# Altium schematic sheet BSP.SchDoc
size A4
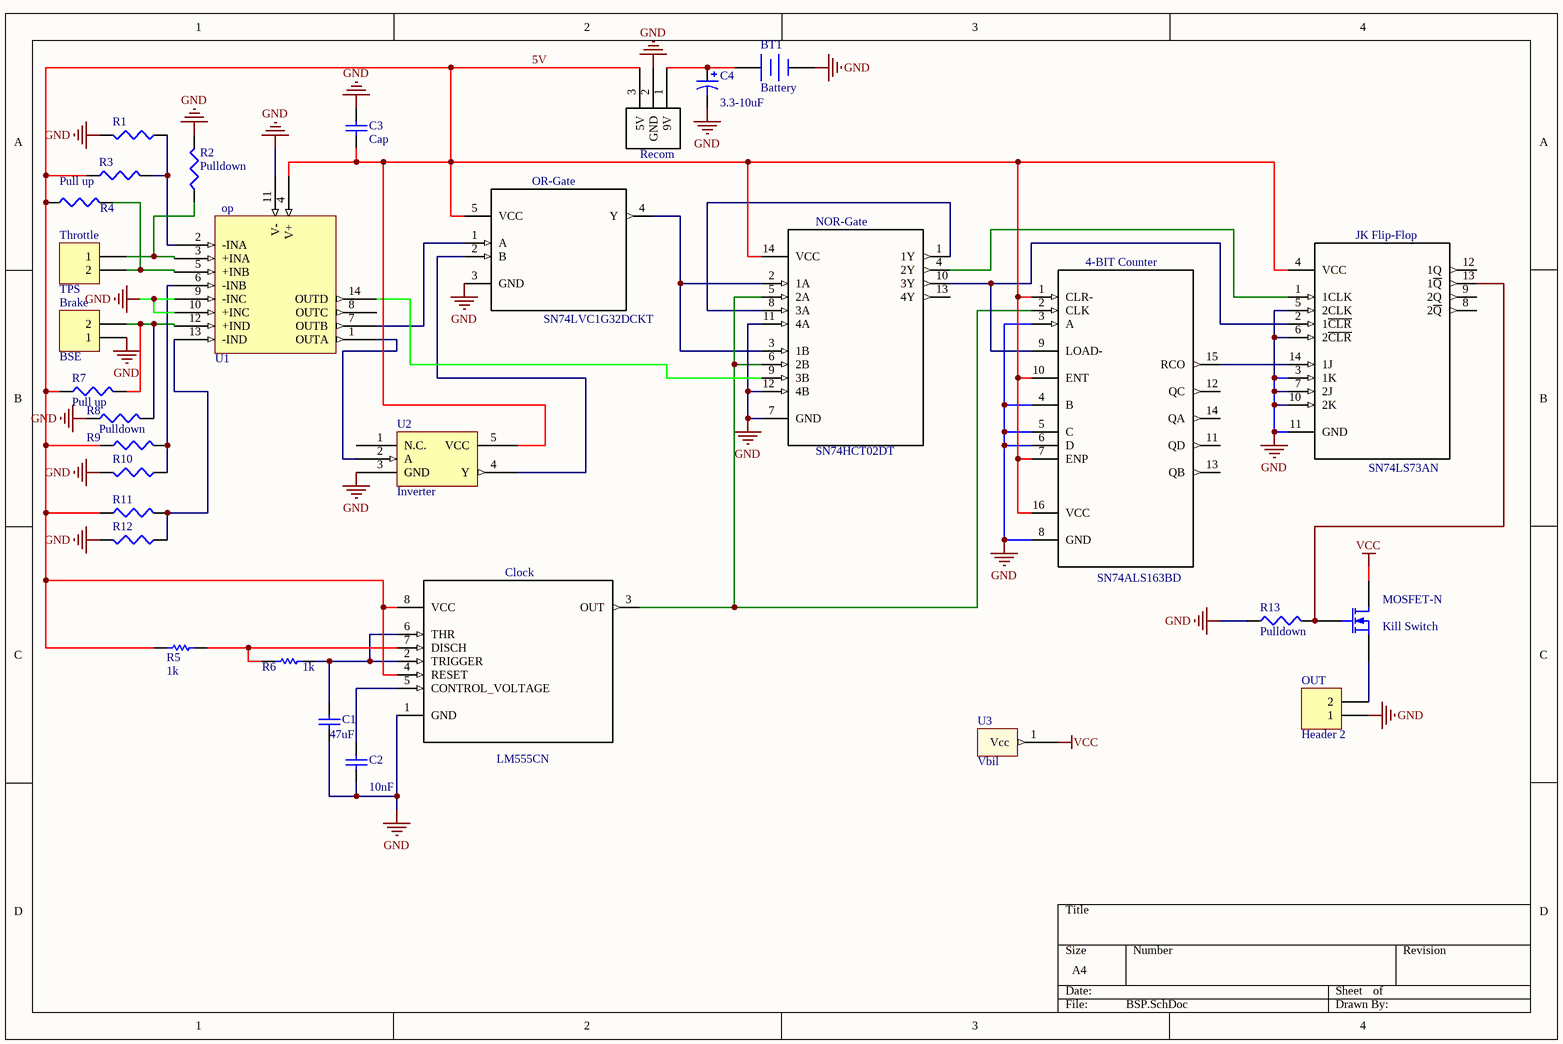
[diagram p0: BSP.SchDoc]

## Parts
4-BIT_Counter  SN74ALS163BD  [SOIC127P600X175-16N]
*  Recom  [RECOMM]
Brake  BSE  [HDR1X2]
BT1  Battery  [HDR1X2]
C1  value 47uF  [C5750]
C2  value 10nF  [Resistor0805]
C3  Cap  [Resistor0805]
C4  value 3.3-10uF  [CAPR5-4X5]  (hidden comment: Cap Pol1)
Clock  LM555CN  [DIP254P762X533-8]
JK_Flip-Flop  SN74LS73AN  [DIP254P762X508-14]
MOSFET-N  Kill Switch  [DPAK228P998X280-3N]
NOR-Gate  SN74HCT02DT  [SOIC127P600X175-14N]
OR-Gate  SN74LVC1G32DCKT  [SOT65P210X110-5N]
OUT  Header 2  [HDR1X2]
R1  (no value)  [Resistor0805]
R2  Pulldown  [Resistor0805]
R3  (no value)  [Resistor0805]
R4  Pull up  [Resistor0805]
R5  R5  value 1k  [Resistor0805]
R6  value 1k  [Resistor0805]
R7  Pull up  [Resistor0805]
R8  Pulldown  [Resistor0805]
R9  (no value)  [Resistor0805]
R10  (no value)  [Resistor0805]
R11  (no value)  [Resistor0805]
R12  (no value)  [Resistor0805]
R13  Pulldown  [Resistor0805]
Throttle  TPS  [HDR1X2H]
U1  op  [SOP127P600X175-14N]
U2  Inverter  [SOT95P245X145-5N]
U3  Vbil  [VCC]

## Nets
GND: 4-BIT_Counter.3(A) 4-BIT_Counter.4(B) 4-BIT_Counter.5(C) 4-BIT_Counter.6(D) 4-BIT_Counter.8(GND) *.2(GND) Brake.1 BT1.2(-) C1.1 C2.1 C3.1 C4.2 Clock.1(GND) JK_Flip-Flop.3(1K) JK_Flip-Flop.5(2CLK) JK_Flip-Flop.6(2~{CLR}) JK_Flip-Flop.7(2J) JK_Flip-Flop.10(2K) JK_Flip-Flop.11(GND) NOR-Gate.7(GND) NOR-Gate.11(4A) NOR-Gate.12(4B) OR-Gate.3(GND) OUT.1 R1.2 R2.2 R8.1 R10.2 R12.2 R13.1 U1.9(-INC) U1.10(+INC) U1.11(V-) U2.3(GND)
VCC: MOSFET-N.1(D) U3.1(Vcc)
5V: 4-BIT_Counter.1(CLR-) 4-BIT_Counter.7(ENP) 4-BIT_Counter.10(ENT) 4-BIT_Counter.16(VCC) *.3(5V) C3.2 Clock.4(RESET) Clock.8(VCC) JK_Flip-Flop.4(VCC) NOR-Gate.14(VCC) OR-Gate.5(VCC) R3.1 R4.1 R5.2 R7.1 R9.1 R11.1 U1.4(V+) U2.5(VCC)
Net4-BIT_Counter_2: 4-BIT_Counter.2(CLK) Clock.3(OUT) NOR-Gate.5(2A) NOR-Gate.6(2B)
Net4-BIT_Counter_9: 4-BIT_Counter.9(LOAD-) JK_Flip-Flop.2(1~{CLR}) NOR-Gate.10(3Y)
Net4-BIT_Counter_15: 4-BIT_Counter.15(RCO) JK_Flip-Flop.14(1J)
Net*_1: *.1(9V) BT1.1(+) C4.1
NetBrake_2: Brake.2 R7.2 R8.2 U1.12(+IND)
NetC1_2: C1.2 Clock.2(TRIGGER) Clock.6(THR) R6.1
NetC2_2: C2.2 Clock.5(CONTROL_VOLTAGE)
NetClock_7: Clock.7(DISCH) R5.1 R6.2
NetJK_Flip-Flop_1: JK_Flip-Flop.1(1CLK) NOR-Gate.4(2Y)
NetJK_Flip-Flop_13: JK_Flip-Flop.13(1~{Q}) MOSFET-N.2(G) R13.2
NetMOSFET-N_3: MOSFET-N.3(S) OUT.2
NetNOR-Gate_1: NOR-Gate.1(1Y) NOR-Gate.8(3A)
NetNOR-Gate_2: NOR-Gate.2(1A) NOR-Gate.3(1B) OR-Gate.4(Y)
NetNOR-Gate_9: NOR-Gate.9(3B) U1.14(OUTD)
NetOR-Gate_1: OR-Gate.1(A) U1.7(OUTB)
NetOR-Gate_2: OR-Gate.2(B) U2.4(Y)
NetR1_1: R1.1 R3.2 U1.2(-INA)
NetR2_1: R2.1 Throttle.2(1) U1.3(+INA)
NetR4_2: R4.2 Throttle.1(2) U1.5(+INB)
NetR9_2: R9.2 R10.1 U1.6(-INB)
NetR11_2: R11.2 R12.1 U1.13(-IND)
NetU1_1: U1.1(OUTA) U2.2(A)

Not connected (* = marked no-connect by the designer): 4-BIT_Counter 11(QD) 12(QC) 13(QB) 14(QA); JK_Flip-Flop 8(2~{Q}) 9(2Q) 12(1Q); NOR-Gate 13(4Y); U1 8(OUTC); U2 1(N.C.)

## Library data of the parts
4-BIT_Counter = SN74ALS163BD: Counter Single 4-Bit Sync Binary UP 16-Pin SOIC Tube; MF: Texas Instruments; Price: 0.74 USD; MP: SN74ALS163BD; Availability: Good; Package: SOIC-16 Texas Instruments; Value: *
* U2 = Component_1
Brake OUT = Header 2: Header, 2-Pin; LatestRevisionDate: 17-Jul-2002; LatestRevisionNote: Re-released for DXP Platform.; Publisher: Altium Limited
BT1 = Battery: Multicell Battery; Published: 24-Mar-1999; LatestRevisionDate: 17-Jul-2002; LatestRevisionNote: Re-released for DXP Platform.; PackageReference: BAT-2; Publisher: Altium Limited; PackageDescription: Battery; 2 Leads
C1-C3 = Cap: Capacitor; Published: 8-Jun-2000; LatestRevisionDate: 17-Jul-2002; LatestRevisionNote: Re-released for DXP Platform.; PackageReference: RAD-0.3; Publisher: Altium Limited; PackageDescription: Radial Cap, Thru-Hole; 2 Leads; 0.3 in Pin Spacing
C4 = Cap Pol1: Polarized Capacitor (Radial); Published: 8-Jun-2000; LatestRevisionDate: 17-Jul-2002; LatestRevisionNote: Re-released for DXP Platform.; PackageReference: RB7.6-15; Publisher: Altium Limited; PackageDescription: Polarized Capacitor (Radial); 2 Leads
Clock = LM555CN: Highly stable 555 timer for generating accurate time delays and oscillation 8-PDIP 0 to 70; MP: LM555CN/NOPB; MF: Texas Instruments; Price: 0.72 USD; Package: DIP-8 Texas Instruments; Availability: Good; Value: *
JK_Flip-Flop = SN74LS73AN: Flip Flop JK-Master-Slave Type Neg-Edge 2-Element 14-Pin PDIP Tube; MF: Texas Instruments; Package: PDIP-14 Texas Instruments; Price: 1.37 USD; Availability: Good; MP: SN74LS73AN; Value: *
MOSFET-N = MOSFET-N: N-Channel MOSFET; Published: 8-Jun-2000; LatestRevisionDate: 17-Jul-2002; LatestRevisionNote: Re-released for DXP Platform.; PackageVersion: 1995/1996; PackageReference: E3; Publisher: Altium Limited; PackageDescription: TO, Flat Index; 3 In-Line, Axial Leads; Body Dia. 4.6mm; Lead Dia. 0.5 mm (max)
NOR-Gate = SN74HCT02DT: Quadruple 2-Input Positive-NO Gates 14-SOIC -40 to 85; MF: Texas Instruments; Package: SOIC-14 Texas Instruments; MP: SN74HCT02DT; Price: 0.42 USD; Availability: Good; Value: *
OR-Gate = SN74LVC1G32DCKT: Single 2-Input Positive-O Gate 5-SC70 -40 to 125; MF: Texas Instruments; Package: SC-70-5 Texas Instruments; Price: 0.46 USD; Availability: Good; MP: SN74LVC1G32DCKT; Value: *
R1-R4 R7-R13 = Res3: Resistor; Published: 8-Jun-2000; LatestRevisionDate: 29-May-2009; LatestRevisionNote: IPC-7351 Footprint Added.; PackageReference: J1-0603; Publisher: Altium Limited; PackageDescription: Chip Resistor
R5 R6 = Res1: Resistor; Published: 8-Jun-2000; LatestRevisionDate: 17-Jul-2002; LatestRevisionNote: Re-released for DXP Platform.; PackageReference: AXIAL-0.3; Publisher: Altium Limited; PackageDescription: Axial Device, Thru-Hole; 2 Leads; 0.3 in Pin Spacing
Throttle = Header 2H: Header, 2-Pin, Right Angle; LatestRevisionDate: 17-Jul-2002; LatestRevisionNote: Re-released for DXP Platform.; Publisher: Altium Limited
U1 = op: OPA4196